# Altium schematic sheet led-monitoring-SN74HC365PW.SchDoc: SN74HC365PW LED Monitoring
size A4; DrawnBy: Dylan Vogel; Organization: UTAT SS; Revision: 1.0
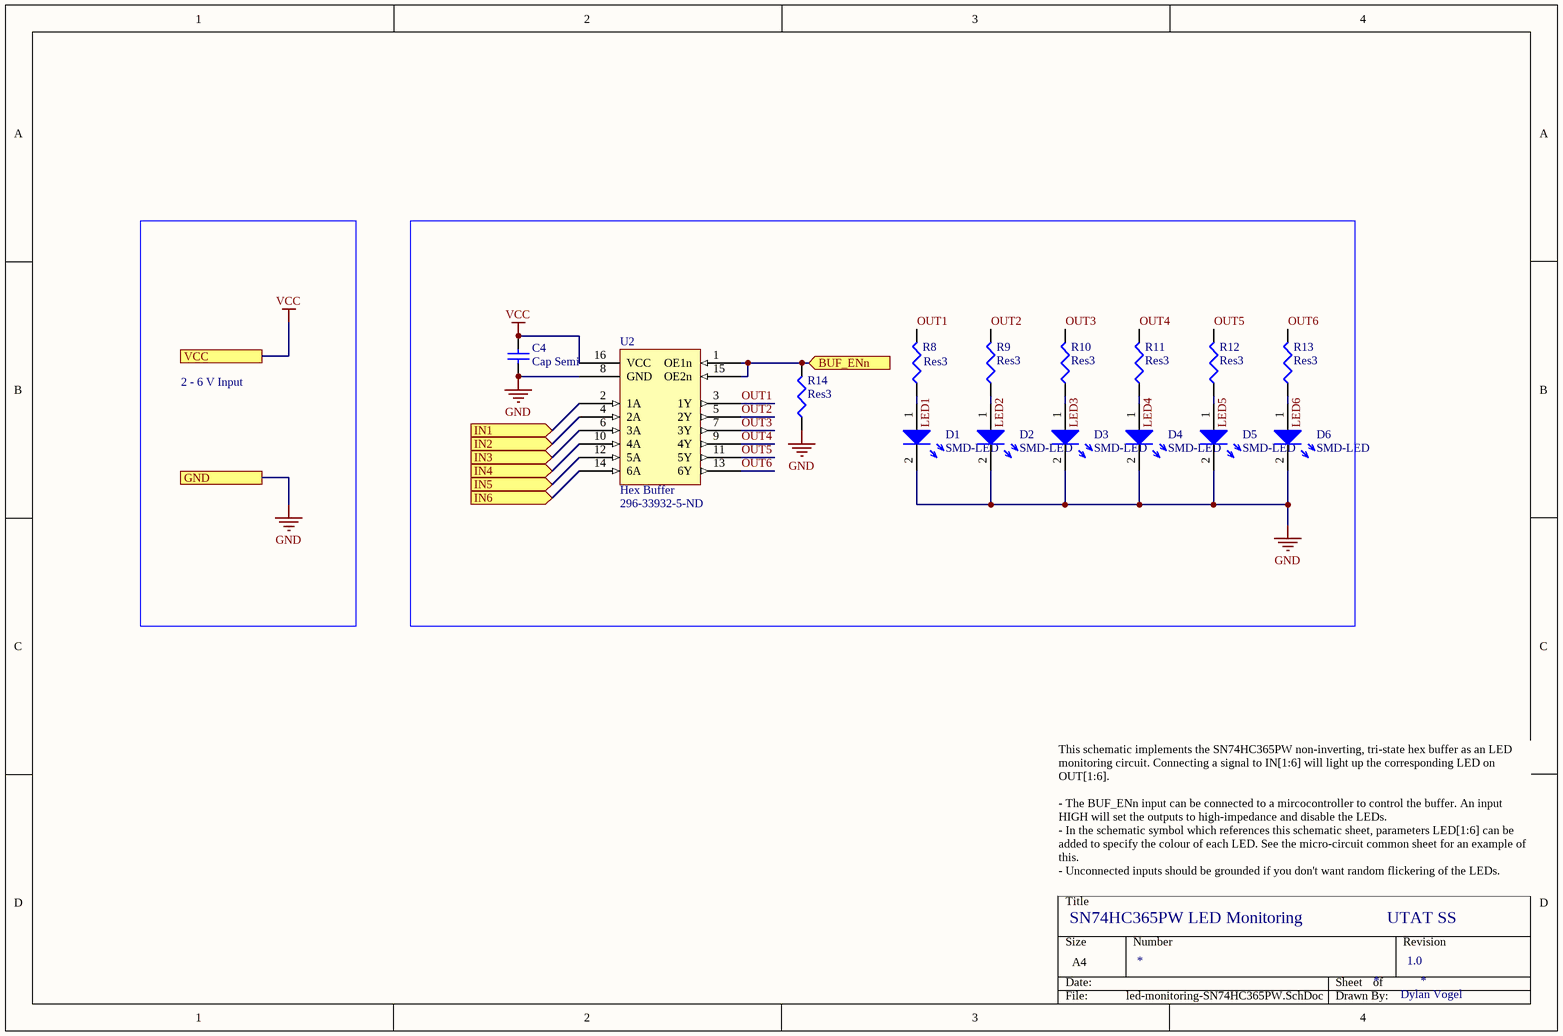
[diagram p0: led-monitoring-SN74HC365PW.SchDoc]

## Parts
C4  Cap Semi  [C1206]
D1  SMD-LED  [0603-LED]
D2  SMD-LED  [0603-LED]
D3  SMD-LED  [0603-LED]
D4  SMD-LED  [0603-LED]
D5  SMD-LED  [0603-LED]
D6  SMD-LED  [0603-LED]
R8  Res3  [J1-0603]
R9  Res3  [J1-0603]
R10  Res3  [J1-0603]
R11  Res3  [J1-0603]
R12  Res3  [J1-0603]
R13  Res3  [J1-0603]
R14  Res3  [J1-0603]
U2  Hex Buffer  Supplier Part Number 1: 296-33932-5-ND  [SOP65P640X120-16N]

## Ports
BUF_ENn (in), GND, IN1 (in), IN2 (in), IN3 (in), IN4 (in), IN5 (in), IN6 (in), VCC

## Nets
GND: C4.1 D1.2 D2.2 D3.2 D4.2 D5.2 D6.2 R14.1 U2.8(GND) ; port GND
VCC: C4.2 U2.16(VCC) ; port VCC
BUF_ENn: R14.2 U2.1(OE1n) U2.15(OE2n) ; port BUF_ENn
IN1: U2.2(1A) ; port IN1
IN2: U2.4(2A) ; port IN2
IN3: U2.6(3A) ; port IN3
IN4: U2.10(4A) ; port IN4
IN5: U2.12(5A) ; port IN5
IN6: U2.14(6A) ; port IN6
LED1: D1.1 R8.1
LED2: D2.1 R9.1
LED3: D3.1 R10.1
LED4: D4.1 R11.1
LED5: D5.1 R12.1
LED6: D6.1 R13.1
OUT1: R8.2 U2.3(1Y)
OUT2: R9.2 U2.5(2Y)
OUT3: R10.2 U2.7(3Y)
OUT4: R11.2 U2.9(4Y)
OUT5: R12.2 U2.11(5Y)
OUT6: R13.2 U2.13(6Y)

## Notes on the sheet
- 2 - 6 V Input
- This schematic implements the SN74HC365PW non-inverting, tri-state hex buffer as an LED monitoring circuit. Connecting a signal to IN[1:6] will light up the corresponding LED on OUT[1:6].
  - The BUF_ENn input can be connected to a mircocontroller to control the buffer. An input HIGH will set the outputs to high-impedance and disable the LEDs.
  - In the schematic symbol which references this schematic sheet, parameters LED[1:6] can be added to specify the colour of each LED. See the micro-circuit common sheet for an example of this.
  - Unconnected inputs should be grounded if you don't want random flickering of the LEDs.

## Library data of the parts
C4 = Cap Semi: Capacitor (Semiconductor SIM Model); Value: 100pF; Published: 8-Jun-2000; LatestRevisionDate: 29-May-2009; LatestRevisionNote: IPC-7351 Footprint Added.; PackageReference: C1206; Publisher: Altium Limited; PackageDescription: Chip Capacitor
D1-D6 = LED: Just a generic LED
R8-R14 = Res3: Resistor; Value: 1K; Published: 8-Jun-2000; LatestRevisionDate: 29-May-2009; LatestRevisionNote: IPC-7351 Footprint Added.; PackageReference: J1-0603; Publisher: Altium Limited; PackageDescription: Chip Resistor
U2 = SN74HC365PW: Hex non-inverting buffer with 3-state outputs; Supplier 1: Digi-Key